# Altium schematic sheet mpc56_mcupower.SchDoc: MCU Power
size Letter; Organization: NewAE Technology Inc.; Address1: 1083 Queen St., Suite 196; Address2: Halifax; Address3: NS; Address4: Canada B3H 0B2; SheetNumber: 5; SheetTotal: 5; SheetApproved: YES
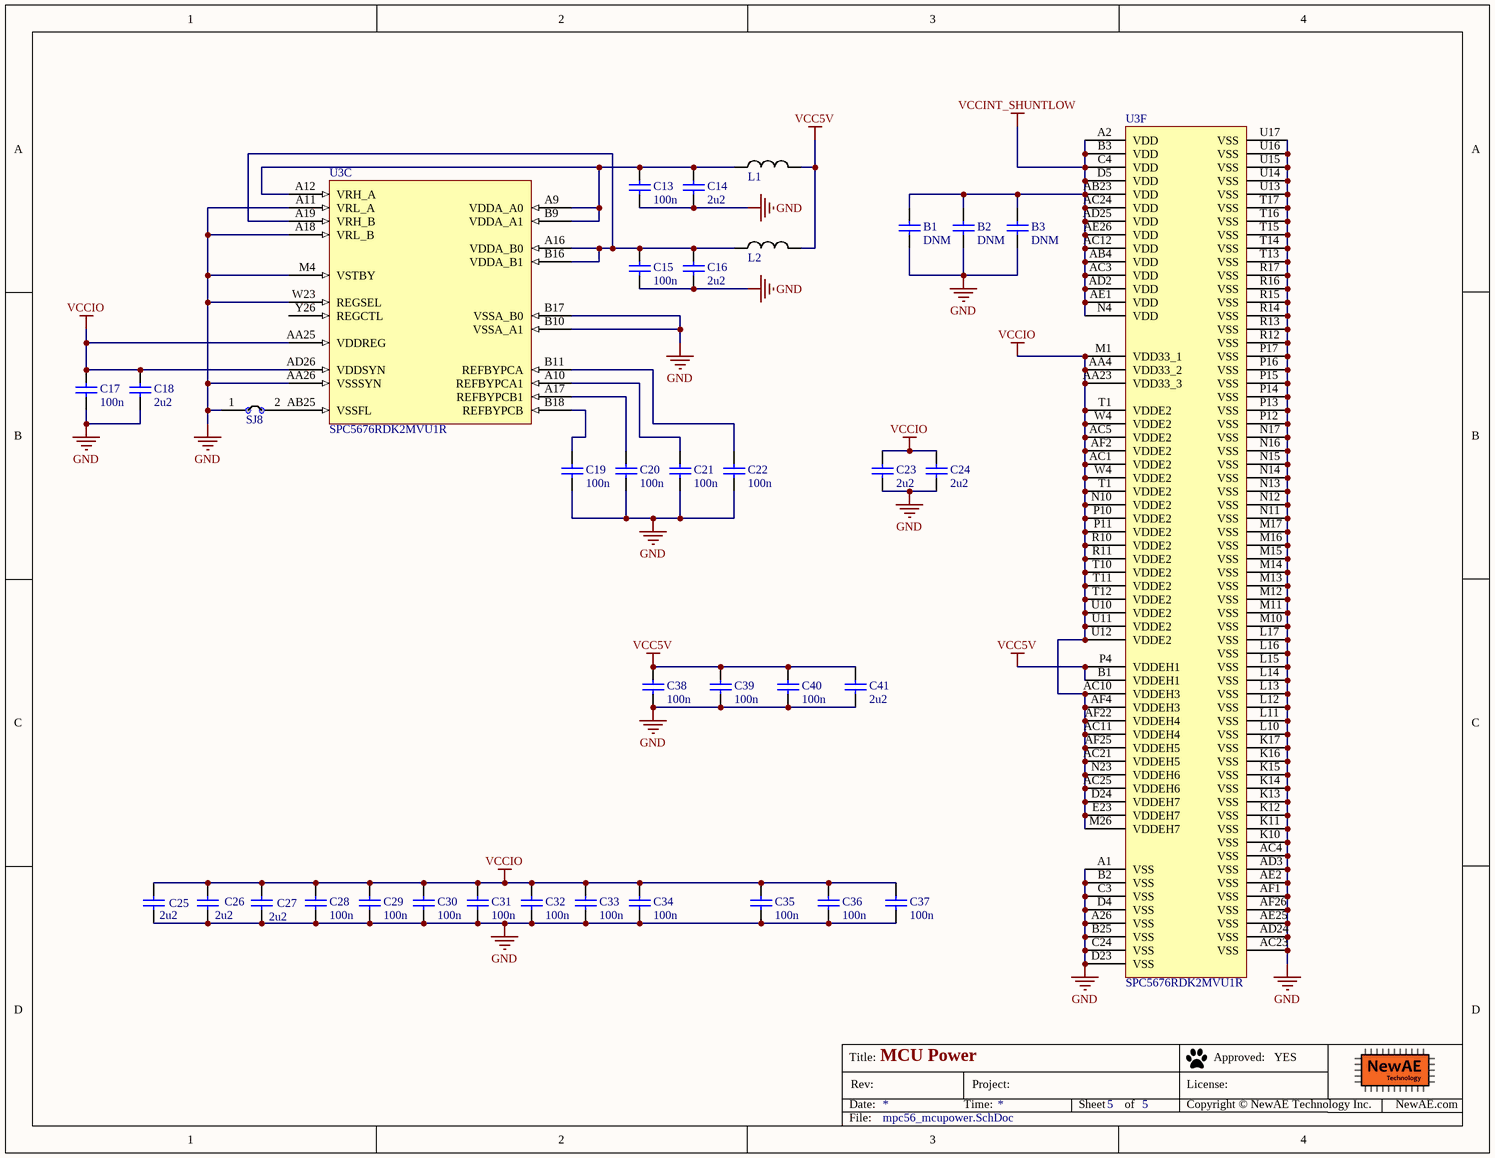
[diagram p0: mpc56_mcupower.SchDoc]

## Parts
B1  DNM  [CAPC0402_M]
B2  DNM  [CAPC0402_M]
B3  DNM  [CAPC0402_M]
C13  100n  [CAPC0402_M]
C14  2u2  [CAPC0603_M]
C15  100n  [CAPC0402_M]
C16  2u2  [CAPC0603_M]
C17  100n  [CAPC0402_M]
C18  2u2  [CAPC0603_M]
C19  100n  [CAPC0402_M]
C20  100n  [CAPC0402_M]
C21  100n  [CAPC0402_M]
C22  100n  [CAPC0402_M]
C23  2u2  [CAPC0603_M]
C24  2u2  [CAPC0603_M]
C25  2u2  [CAPC0603_M]
C26  2u2  [CAPC0603_M]
C27  2u2  [CAPC0603_M]
C28  100n  [CAPC0402_M]
C29  100n  [CAPC0402_M]
C30  100n  [CAPC0402_M]
C31  100n  [CAPC0402_M]
C32  100n  [CAPC0402_M]
C33  100n  [CAPC0402_M]
C34  100n  [CAPC0402_M]
C35  100n  [CAPC0402_M]
C36  100n  [CAPC0402_M]
C37  100n  [CAPC0402_M]
C38  100n  [CAPC0402_M]
C39  100n  [CAPC0402_M]
C40  100n  [CAPC0402_M]
C41  2u2  [CAPC0603_M]
L1  1k @ 1Mhz  [IND_0603]  (value not drawn)
L2  1k @ 1Mhz  [IND_0603]  (value not drawn)
SJ8  NC  [SJ_2S_NC]  (value not drawn)  (no BOM)
U3  SPC5676RDK2MVU1R  [TEPBGA416_27x27]  (parts C,F of 6)

## Nets
GND: B1.2 B2.2 B3.2 C13.2 C14.2 C15.2 C16.2 C17.2 C18.2 C19.2 C20.2 C21.2 C22.2 C23.2 C24.2 C25.2 C26.2 C27.2 C28.2 C29.2 C30.2 C31.2 C32.2 C33.2 C34.2 C35.2 C36.2 C37.2 C38.2 C39.2 C40.2 C41.2 SJ8.1 U3.A1(VSS) U3.A11(VRL_A) U3.A18(VRL_B) U3.A26(VSS) U3.AA26(VSSSYN) U3.AC4(VSS) U3.AC23(VSS) U3.AD3(VSS) U3.AD24(VSS) U3.AE2(VSS) U3.AE25(VSS) U3.AF1(VSS) U3.AF26(VSS) U3.B2(VSS) U3.B10(VSSA_A1) U3.B17(VSSA_B0) U3.B25(VSS) U3.C3(VSS) U3.C24(VSS) U3.D4(VSS) U3.D23(VSS) U3.K10(VSS) U3.K11(VSS) U3.K12(VSS) U3.K13(VSS) U3.K14(VSS) U3.K15(VSS) U3.K16(VSS) U3.K17(VSS) U3.L10(VSS) U3.L11(VSS) U3.L12(VSS) U3.L13(VSS) U3.L14(VSS) U3.L15(VSS) U3.L16(VSS) U3.L17(VSS) U3.M4(VSTBY) U3.M10(VSS) U3.M11(VSS) U3.M12(VSS) U3.M13(VSS) U3.M14(VSS) U3.M15(VSS) U3.M16(VSS) U3.M17(VSS) U3.N11(VSS) U3.N12(VSS) U3.N13(VSS) U3.N14(VSS) U3.N15(VSS) U3.N16(VSS) U3.N17(VSS) U3.P12(VSS) U3.P13(VSS) U3.P14(VSS) U3.P15(VSS) U3.P16(VSS) U3.P17(VSS) U3.R12(VSS) U3.R13(VSS) U3.R14(VSS) U3.R15(VSS) U3.R16(VSS) U3.R17(VSS) U3.T13(VSS) U3.T14(VSS) U3.T15(VSS) U3.T16(VSS) U3.T17(VSS) U3.U13(VSS) U3.U14(VSS) U3.U15(VSS) U3.U16(VSS) U3.U17(VSS) U3.W23(REGSEL)
VCC5V: C38.1 C39.1 C40.1 C41.1 L1.2 L2.2 U3.B1(VDDEH1) U3.P4(VDDEH1)
VCCINT_SHUNTLOW: B1.1 B2.1 B3.1 U3.A2(VDD) U3.AB4(VDD) U3.AB23(VDD) U3.AC3(VDD) U3.AC12(VDD) U3.AC24(VDD) U3.AD2(VDD) U3.AD25(VDD) U3.AE1(VDD) U3.AE26(VDD) U3.B3(VDD) U3.C4(VDD) U3.D5(VDD) U3.N4(VDD)
VCCIO: C17.1 C18.1 C23.1 C24.1 C25.1 C26.1 C27.1 C28.1 C29.1 C30.1 C31.1 C32.1 C33.1 C34.1 C35.1 C36.1 C37.1 U3.AA4(VDD33_2) U3.AA23(VDD33_3) U3.AA25(VDDREG) U3.AC1(VDDE2) U3.AC5(VDDE2) U3.AC10(VDDEH3) U3.AC11(VDDEH4) U3.AC21(VDDEH5) U3.AC25(VDDEH6) U3.AD26(VDDSYN) U3.AF2(VDDE2) U3.AF4(VDDEH3) U3.AF22(VDDEH4) U3.AF25(VDDEH5) U3.D24(VDDEH7) U3.E23(VDDEH7) U3.M1(VDD33_1) U3.M26(VDDEH7) U3.N10(VDDE2) U3.N23(VDDEH6) U3.P10(VDDE2) U3.P11(VDDE2) U3.R10(VDDE2) U3.R11(VDDE2) U3.T1(VDDE2) U3.T10(VDDE2) U3.T11(VDDE2) U3.T12(VDDE2) U3.U10(VDDE2) U3.U11(VDDE2) U3.U12(VDDE2) U3.W4(VDDE2)
NetC13_1: C13.1 C14.1 L1.1 U3.A9(VDDA_A0) U3.A12(VRH_A) U3.B9(VDDA_A1)
NetC15_1: C15.1 C16.1 L2.1 U3.A16(VDDA_B0) U3.A19(VRH_B) U3.B16(VDDA_B1)
NetC19_1: C19.1 U3.B18(REFBYPCB)
NetC20_1: C20.1 U3.A17(REFBYPCB1)
NetC21_1: C21.1 U3.A10(REFBYPCA1)
NetC22_1: C22.1 U3.B11(REFBYPCA)
NetSJ8_2: SJ8.2 U3.AB25(VSSFL)

Not connected (* = marked no-connect by the designer): U3 Y26(REGCTL)

## Notes on the sheet
- Title:
- Date:
- Rev:
- Time:
- Project:
- Sheet
- of
- License:
- Copyright © NewAE Technology Inc.
- Approved:
- NewAE.com
- File:

## Library data of the parts
B1-B3 = CCHIP-DNM-0402: DNM, 0402; Case-EIA: 0402; Component Group: Capacitor; Part Number: CCHIP-DNM-0402; Component Kind: Standard; Component Type: Standard; Footprint: 0402; Pin Count: 2; Value: DNM; Mounting Technology: SMT
C13 C15 C17 C19-C22 C28-C40 = CCHIP-100n-0402: 100n, 0402; Case-EIA: 0402; Part Number: CCHIP-100n-0402; Component Kind: Standard; Component Type: Standard; Footprint: 0402; Pin Count: 2; Value: 100n; Mounting Technology: SMT
C14 C16 C18 C23 C24 C41 = CCHIP-2u2-0603: 2u2, 0603; Case-EIA: 0603; Case-Metric: 1608; Part Number: CCHIP-2u2-0603; Component Kind: Standard; Component Type: Standard; Footprint: 0603; Pin Count: 2; Value: 2u2; Mounting Technology: SMT
C25-C27 = CCHIP-2u2-0603: 2u2, 0603; Manufacture 1: Samsung; Manufacture Part Number 1: CL10B225KP8NNNC; Component Group: Capacitor; Case-EIA: 0603; Case-Metric: 1608; Rated Voltage: 10VDC; Part Number: CCHIP-2u2-0603; Footprint: 0603; Pin Count: 2; Supplier 1: Digi-Key; Supplier Part Number 1: 1276-1134-2-ND; Value: 2u2; Mounting Technology: SMT; Component Kind: Standard; Component Type: Standard
L1 L2 = FBCHIP-1k-0603: Ferrite Beads HI CUR CHIP BD 0603 1000OHMS 25%; Manufacture 1: Taiyo Yuden; Manufacture Part Number 1: FBMH1608HM102-T / FBMH1608HM102-T / FBMH1608HM102-T / FBMH1608HM102-T; Component Group: Inductor; PP Material Stack: 0; Part Number: FBCHIP-1k-0603; Footprint: 0603; Pin Count: 2; Supplier 1: Mouser; Supplier Part Number 1: 963-FBMH1608HM102-T; Mounting Technology: SMT; RoHS: Yes; Component Kind: Standard; Component Type: Standard; PP Rotation: 0
SJ8 = SJ_2S: Solder Jumper, NC; Part Number: SJ_2S; Component Type: Standard (No BOM); Pin Count: 2
U3 = SPC5676RDK2MVU1R: Dual-Core PPC, Automotive; Manufacture 1: NXP; Component Group: Digital IC; PP Material Stack: 0; Part Number: SPC5676RDK2MVU1R; Manufacture Part Number 1: SPC5676RDK2MVU1R; Pin Count: 412; Supplier 1: Mouser; Mounting Technology: SMT; RoHS: Yes; Component Kind: Standard; Component Type: Standard; PP Rotation: 0